# Altium schematic sheet Sheet5.SchDoc
size A4
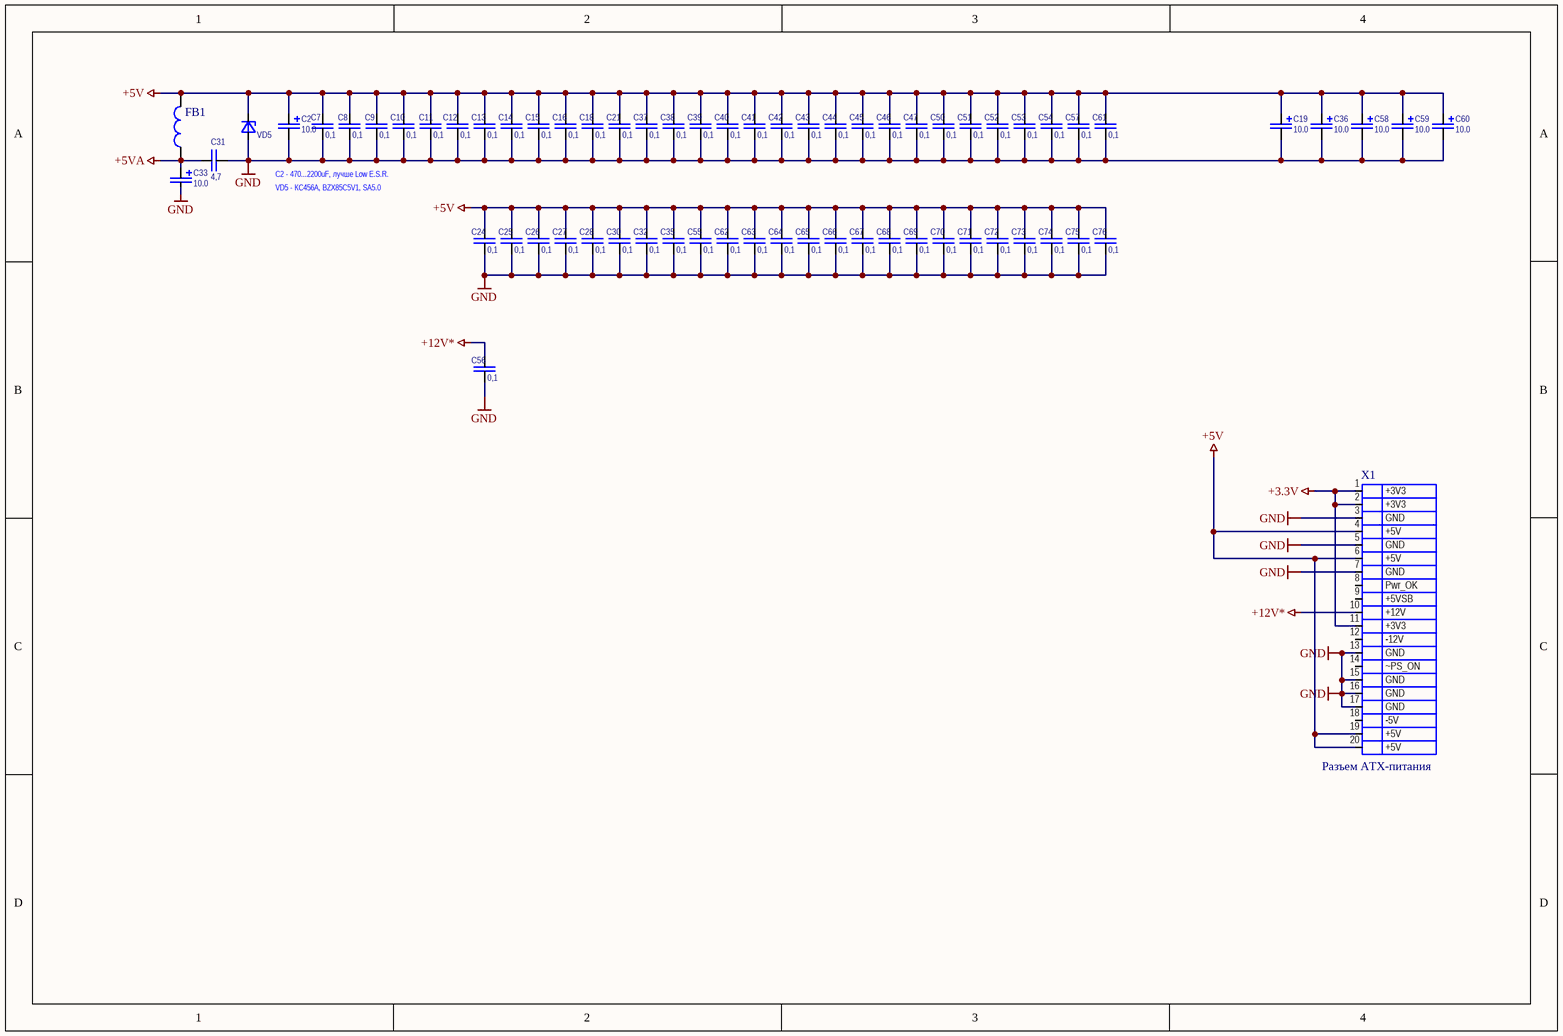
[diagram p0: Sheet5.SchDoc]

## Parts
C2  value 10.0  [AL CAP P=5]  (hidden comment: CP)
C7  value 0,1  [CAP]
C8  value 0,1  [CAP]
C9  value 0,1  [CAP]
C10  value 0,1  [CAP]
C11  value 0,1  [CAP]
C12  value 0,1  [CAP]
C13  value 0,1  [CAP]
C14  value 0,1  [CAP]
C15  value 0,1  [CAP]
C16  value 0,1  [CAP]
C18  value 0,1  [CAP]
C19  value 10.0  [AL CAP P=2.5 D=3]  (hidden comment: CP)
C21  value 0,1  [CAP]
C24  value 0,1  [CAP]
C25  value 0,1  [CAP]
C26  value 0,1  [CAP]
C27  value 0,1  [CAP]
C28  value 0,1  [CAP]
C30  value 0,1  [CAP]
C31  value 4,7  [CAP]
C32  value 0,1  [CAP]
C33  value 10.0  [AL CAP P=2.5 D=3]  (hidden comment: CP)
C35  value 0,1  [CAP]
C36  value 10.0  [AL CAP P=2.5 D=3]  (hidden comment: CP)
C37  value 0,1  [CAP]
C38  value 0,1  [CAP]
C39  value 0,1  [CAP]
C40  value 0,1  [CAP]
C41  value 0,1  [CAP]
C42  value 0,1  [CAP]
C43  value 0,1  [CAP]
C44  value 0,1  [CAP]
C45  value 0,1  [CAP]
C46  value 0,1  [CAP]
C47  value 0,1  [CAP]
C50  value 0,1  [CAP]
C51  value 0,1  [CAP]
C52  value 0,1  [CAP]
C53  value 0,1  [CAP]
C54  value 0,1  [CAP]
C55  value 0,1  [CAP]
C56  value 0,1  [CAP]
C57  value 0,1  [CAP]
C58  value 10.0  [AL CAP P=2.5 D=3]  (hidden comment: CP)
C59  value 10.0  [AL CAP P=2.5 D=3]  (hidden comment: CP)
C60  value 10.0  [AL CAP P=2.5 D=3]  (hidden comment: CP)
C61  value 0,1  [CAP]
C62  value 0,1  [CAP]
C63  value 0,1  [CAP]
C64  value 0,1  [CAP]
C65  value 0,1  [CAP]
C66  value 0,1  [CAP]
C67  value 0,1  [CAP]
C68  value 0,1  [CAP]
C69  value 0,1  [CAP]
C70  value 0,1  [CAP]
C71  value 0,1  [CAP]
C72  value 0,1  [CAP]
C73  value 0,1  [CAP]
C74  value 0,1  [CAP]
C75  value 0,1  [CAP]
C76  value 0,1  [CAP]
FB1  FBEAD  [L AIXAL]  (value not drawn)
VD5  BZX85C5V1  [BZX85C5V1]  (value not drawn)
X1  Разъем ATX-питания  [ATXPOWER]

## Nets
+3.3V: X1.1(+3V3) X1.2(+3V3) X1.11(+3V3)
+5V: C2.1 C7.1 C8.1 C9.1 C10.1 C11.1 C12.1 C13.1 C14.1 C15.1 C16.1 C18.1 C19.1 C21.1 C24.1 C25.1 C26.1 C27.1 C28.1 C30.1 C32.1 C35.1 C36.1 C37.1 C38.1 C39.1 C40.1 C41.1 C42.1 C43.1 C44.1 C45.1 C46.1 C47.1 C50.1 C51.1 C52.1 C53.1 C54.1 C55.1 C57.1 C58.1 C59.1 C60.1 C61.1 C62.1 C63.1 C64.1 C65.1 C66.1 C67.1 C68.1 C69.1 C70.1 C71.1 C72.1 C73.1 C74.1 C75.1 C76.1 FB1.2 VD5.2 X1.4(+5V) X1.6(+5V) X1.19(+5V) X1.20(+5V)
+5VA: C31.1 C33.1 FB1.1
+12V*: C56.1 X1.10(+12V)
GND: C2.2 C7.2 C8.2 C9.2 C10.2 C11.2 C12.2 C13.2 C14.2 C15.2 C16.2 C18.2 C19.2 C21.2 C24.2 C25.2 C26.2 C27.2 C28.2 C30.2 C31.2 C32.2 C33.2 C35.2 C36.2 C37.2 C38.2 C39.2 C40.2 C41.2 C42.2 C43.2 C44.2 C45.2 C46.2 C47.2 C50.2 C51.2 C52.2 C53.2 C54.2 C55.2 C56.2 C57.2 C58.2 C59.2 C60.2 C61.2 C62.2 C63.2 C64.2 C65.2 C66.2 C67.2 C68.2 C69.2 C70.2 C71.2 C72.2 C73.2 C74.2 C75.2 C76.2 VD5.1 X1.3(GND) X1.5(GND) X1.7(GND) X1.13(GND) X1.15(GND) X1.16(GND) X1.17(GND)

Not connected (* = marked no-connect by the designer): X1 8(Pwr_OK) 9(+5VSB) 12(-12V) 14(~PS_ON) 18(-5V)

## Notes on the sheet
- C2 - 470...2200uF, лучше Low E.S.R.
- VD5 - КС456А, BZX85C5V1, SA5.0

## Library data of the parts
C7-C16 C18 C21 C24-C28 C30-C32 C35 C37-C47 C50-C57 C61-C76 = C: Type: C
VD5 = BZX85C5V1: Type: ZENER
X1 = ATX POWER CONN
C2 C19 C33 C36 C58-C60 = CP: Type: CP